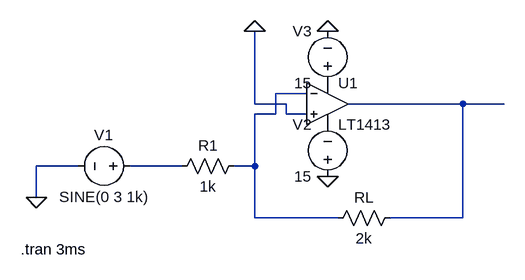
[diagram p0: schematic EXP-5_InvertingOPAMP.asc]
EXP-5_InvertingOPAMP.asc, the LTspice schematic file:
Version 4
SHEET 1 880 680
WIRE 128 128 80 128
WIRE 48 144 48 32
WIRE 96 144 48 144
WIRE 368 144 192 144
WIRE 432 144 368 144
WIRE 80 160 80 128
WIRE 80 160 48 160
WIRE 96 160 96 144
WIRE 128 160 96 160
WIRE -224 240 -288 240
WIRE -64 240 -144 240
WIRE 48 240 48 160
WIRE 48 240 16 240
WIRE -288 288 -288 240
WIRE 48 320 48 240
WIRE 176 320 48 320
WIRE 368 320 368 144
WIRE 368 320 256 320
FLAG 48 32 0
FLAG -288 288 0
FLAG 160 32 0
FLAG 160 256 0
SYMBOL voltage -128 240 R90
WINDOW 0 -32 56 VBottom 2
WINDOW 3 32 56 VTop 2
WINDOW 123 0 0 Left 0
WINDOW 39 0 0 Left 0
SYMATTR InstName V1
SYMATTR Value SINE(0 3 1k)
SYMBOL res 32 224 R90
WINDOW 0 0 56 VBottom 2
WINDOW 3 32 56 VTop 2
SYMATTR InstName R1
SYMATTR Value 1k
SYMBOL res 272 304 R90
WINDOW 0 0 56 VBottom 2
WINDOW 3 32 56 VTop 2
SYMATTR InstName RL
SYMATTR Value 2k
SYMBOL OpAmps\\LT1413 160 80 R0
SYMATTR InstName U1
SYMBOL voltage 160 272 R180
WINDOW 0 24 96 Left 2
WINDOW 3 24 16 Left 2
WINDOW 123 0 0 Left 0
WINDOW 39 0 0 Left 0
SYMATTR InstName V2
SYMATTR Value 15
SYMBOL voltage 160 128 R180
WINDOW 0 24 96 Left 2
WINDOW 3 24 16 Left 2
WINDOW 123 0 0 Left 0
WINDOW 39 0 0 Left 0
SYMATTR InstName V3
SYMATTR Value 15
TEXT -312 368 Left 2 !.tran 3ms

The netlist it stands for:
* EXP-5_InvertingOPAMP.asc
V1 N003 0 SINE(0 3 1k)
R1 N001 N003 1k
RL N002 N001 2k
XU1 0 N001 P001 P002 N002 LT1413  ; pins In+ In- V+ V- OUT
V2 0 P002 15
V3 P001 0 15
.tran 3ms
.lib LTC.lib
.backanno
.end